# Altium schematic sheet General.SchDoc
size A3
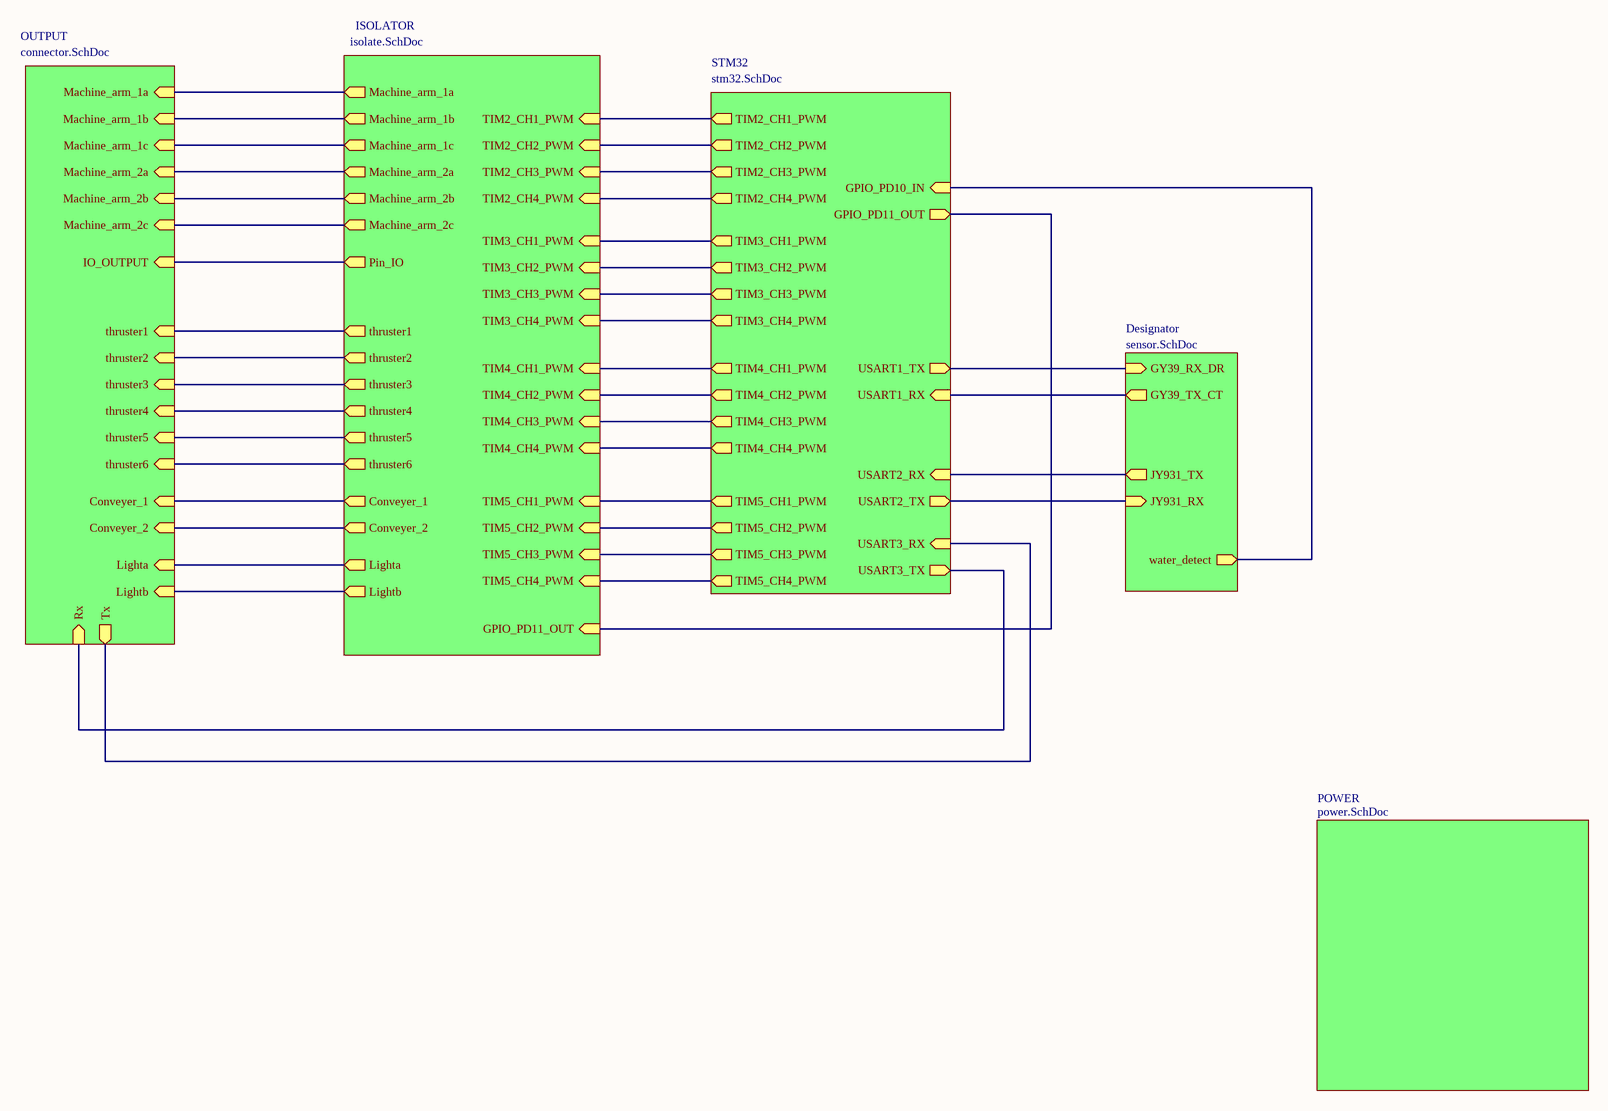
[diagram p0: General.SchDoc]

## Sub-sheets
Designator = sensor.SchDoc: water_detect (out), JY931_TX (out), GY39_TX_CT (out), GY39_RX_DR (in), JY931_RX (in)
ISOLATOR = isolate.SchDoc: Machine_arm_1a (out), Machine_arm_2b (out), Machine_arm_1b (out), Machine_arm_1c (out), thruster4 (out), Conveyer_1 (out), Machine_arm_2c (out), Conveyer_2 (out), thruster2 (out), Machine_arm_2a (out), thruster6 (out), thruster3 (out), Lightb (out), TIM2_CH4_PWM (in), thruster5 (out), TIM2_CH3_PWM (in), TIM4_CH3_PWM (in), TIM4_CH1_PWM (in), TIM3_CH2_PWM (in), TIM4_CH4_PWM (in), TIM3_CH1_PWM (in), TIM3_CH3_PWM (in), TIM3_CH4_PWM (in), TIM5_CH3_PWM (in), TIM4_CH2_PWM (in), TIM5_CH2_PWM (in), TIM5_CH4_PWM (in), GPIO_PD11_OUT (in), Pin_IO (out), TIM5_CH1_PWM (in), TIM2_CH2_PWM (in), Lighta (out), TIM2_CH1_PWM (in), thruster1 (out)
OUTPUT = connector.SchDoc: Conveyer_1 (in), Machine_arm_2c (in), Machine_arm_2b (in), Machine_arm_1c (in), thruster6 (in), Machine_arm_1b (in), thruster4 (in), thruster2 (in), Conveyer_2 (in), Machine_arm_1a (in), thruster5 (in), Machine_arm_2a (in), thruster3 (in), thruster1 (in), Tx (out), Rx (in), Lighta (in), Lightb (in), IO_OUTPUT (in)
POWER = power.SchDoc: no entries
STM32 = stm32.SchDoc: TIM2_CH4_PWM (out), TIM5_CH2_PWM (out), TIM2_CH3_PWM (out), USART1_TX (out), TIM5_CH1_PWM (out), USART2_RX (in), TIM3_CH3_PWM (out), GPIO_PD11_OUT (out), USART3_TX (out), TIM4_CH1_PWM (out), USART3_RX (in), TIM2_CH1_PWM (out), TIM3_CH2_PWM (out), TIM3_CH1_PWM (out), USART1_RX (in), GPIO_PD10_IN (in), TIM4_CH2_PWM (out), TIM3_CH4_PWM (out), TIM4_CH3_PWM (out), TIM4_CH4_PWM (out), USART2_TX (out), TIM2_CH2_PWM (out), TIM5_CH4_PWM (out), TIM5_CH3_PWM (out)

## Nets
(unnamed): sheet OUTPUT/Conveyer_1, sheet ISOLATOR/Conveyer_1
(unnamed): sheet OUTPUT/Machine_arm_2c, sheet ISOLATOR/Machine_arm_2c
(unnamed): sheet OUTPUT/Machine_arm_2b, sheet ISOLATOR/Machine_arm_2b
(unnamed): sheet OUTPUT/Machine_arm_1c, sheet ISOLATOR/Machine_arm_1c
(unnamed): sheet OUTPUT/thruster6, sheet ISOLATOR/thruster6
(unnamed): sheet OUTPUT/Machine_arm_1b, sheet ISOLATOR/Machine_arm_1b
(unnamed): sheet OUTPUT/thruster4, sheet ISOLATOR/thruster4
(unnamed): sheet OUTPUT/thruster2, sheet ISOLATOR/thruster2
(unnamed): sheet OUTPUT/Conveyer_2, sheet ISOLATOR/Conveyer_2
(unnamed): sheet OUTPUT/Machine_arm_1a, sheet ISOLATOR/Machine_arm_1a
(unnamed): sheet OUTPUT/thruster5, sheet ISOLATOR/thruster5
(unnamed): sheet OUTPUT/Machine_arm_2a, sheet ISOLATOR/Machine_arm_2a
(unnamed): sheet OUTPUT/thruster3, sheet ISOLATOR/thruster3
(unnamed): sheet OUTPUT/thruster1, sheet ISOLATOR/thruster1
(unnamed): sheet OUTPUT/Tx, sheet STM32/USART3_RX
(unnamed): sheet OUTPUT/Rx, sheet STM32/USART3_TX
(unnamed): sheet OUTPUT/Lighta, sheet ISOLATOR/Lighta
(unnamed): sheet OUTPUT/Lightb, sheet ISOLATOR/Lightb
(unnamed): sheet OUTPUT/IO_OUTPUT, sheet ISOLATOR/Pin_IO
(unnamed): sheet STM32/TIM2_CH4_PWM, sheet ISOLATOR/TIM2_CH4_PWM
(unnamed): sheet STM32/TIM5_CH2_PWM, sheet ISOLATOR/TIM5_CH2_PWM
(unnamed): sheet STM32/TIM2_CH3_PWM, sheet ISOLATOR/TIM2_CH3_PWM
(unnamed): sheet STM32/USART1_TX, sheet Designator/GY39_RX_DR
(unnamed): sheet STM32/TIM5_CH1_PWM, sheet ISOLATOR/TIM5_CH1_PWM
(unnamed): sheet STM32/USART2_RX, sheet Designator/JY931_TX
(unnamed): sheet STM32/TIM3_CH3_PWM, sheet ISOLATOR/TIM3_CH3_PWM
(unnamed): sheet STM32/GPIO_PD11_OUT, sheet ISOLATOR/GPIO_PD11_OUT
(unnamed): sheet STM32/TIM4_CH1_PWM, sheet ISOLATOR/TIM4_CH1_PWM
(unnamed): sheet STM32/TIM2_CH1_PWM, sheet ISOLATOR/TIM2_CH1_PWM
(unnamed): sheet STM32/TIM3_CH2_PWM, sheet ISOLATOR/TIM3_CH2_PWM
(unnamed): sheet STM32/TIM3_CH1_PWM, sheet ISOLATOR/TIM3_CH1_PWM
(unnamed): sheet STM32/USART1_RX, sheet Designator/GY39_TX_CT
(unnamed): sheet STM32/GPIO_PD10_IN, sheet Designator/water_detect
(unnamed): sheet STM32/TIM4_CH2_PWM, sheet ISOLATOR/TIM4_CH2_PWM
(unnamed): sheet STM32/TIM3_CH4_PWM, sheet ISOLATOR/TIM3_CH4_PWM
(unnamed): sheet STM32/TIM4_CH3_PWM, sheet ISOLATOR/TIM4_CH3_PWM
(unnamed): sheet STM32/TIM4_CH4_PWM, sheet ISOLATOR/TIM4_CH4_PWM
(unnamed): sheet STM32/USART2_TX, sheet Designator/JY931_RX
(unnamed): sheet STM32/TIM2_CH2_PWM, sheet ISOLATOR/TIM2_CH2_PWM
(unnamed): sheet STM32/TIM5_CH4_PWM, sheet ISOLATOR/TIM5_CH4_PWM
(unnamed): sheet STM32/TIM5_CH3_PWM, sheet ISOLATOR/TIM5_CH3_PWM